# Altium schematic sheet key.SchDoc
size A4
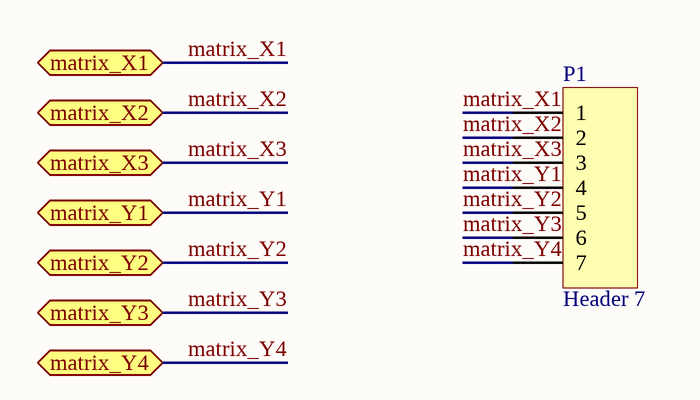
[diagram p0: key.SchDoc]

## Parts
P1  Header 7  [HDR1X7]

## Ports
matrix_X1, matrix_X2, matrix_X3, matrix_Y1, matrix_Y2, matrix_Y3, matrix_Y4

## Nets
matrix_X1: P1.1 ; port matrix_X1
matrix_X2: P1.2 ; port matrix_X2
matrix_X3: P1.3 ; port matrix_X3
matrix_Y1: P1.4 ; port matrix_Y1
matrix_Y2: P1.5 ; port matrix_Y2
matrix_Y3: P1.6 ; port matrix_Y3
matrix_Y4: P1.7 ; port matrix_Y4

## Library data of the parts
P1 = Header 7: Header, 7-Pin; LatestRevisionDate: 17-Jul-2002; LatestRevisionNote: Re-released for DXP Platform.; Publisher: Altium Limited